# Altium project project.PrjPcb
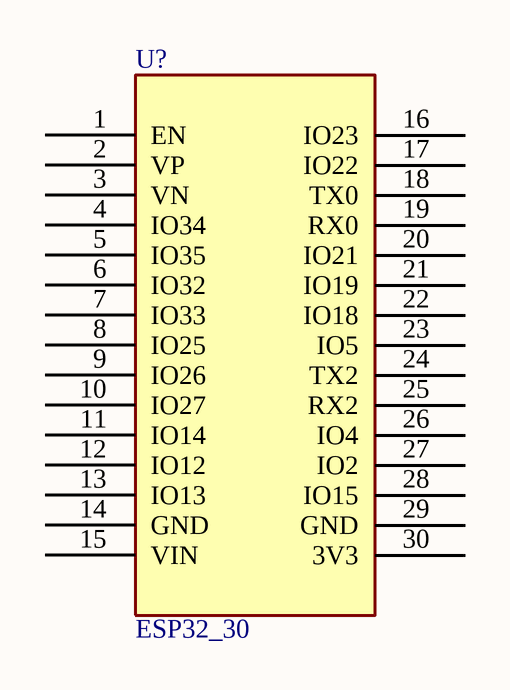
[diagram p0: schematic.SchDoc]
1 sheet, 1 parts. Net scope: global (net labels, ports and power ports of the same name join across sheets).
Board file: pcb.PcbDoc

## Sheet schematic.SchDoc
size A4; SheetNumber: 1; SheetTotal: 1

### Parts
U?  ESP32_30  [ESP32_30]

### Nets

Not connected (* = marked no-connect by the designer): U? 1(EN) 2(VP) 3(VN) 4(IO34) 5(IO35) 6(IO32) 7(IO33) 8(IO25) 9(IO26) 10(IO27) 11(IO14) 12(IO12) 13(IO13) 14(GND) 15(VIN) 16(IO23) 17(IO22) 18(TX0) 19(RX0) 20(IO21) 21(IO19) 22(IO18) 23(IO5) 24(TX2) 25(RX2) 26(IO4) 27(IO2) 28(IO15) 29(GND) 30(3V3)

### Library data of the parts
U? = ESP32_30: Microcontoller Board 30 Pins Wifi 2.4GHz BLE 4.2 ESP32-WROOM-32D; ComponentLink1Description: Datasheet; ComponentLink1URL: https://www.mouser.com/datasheet/2/891/esp32_wroom_32d_esp32_wroom_32u_datasheet_en-1365844.pdf